# Altium schematic sheet ideal_diode.SchDoc
size A4; SheetNumber: 4; SheetTotal: 7
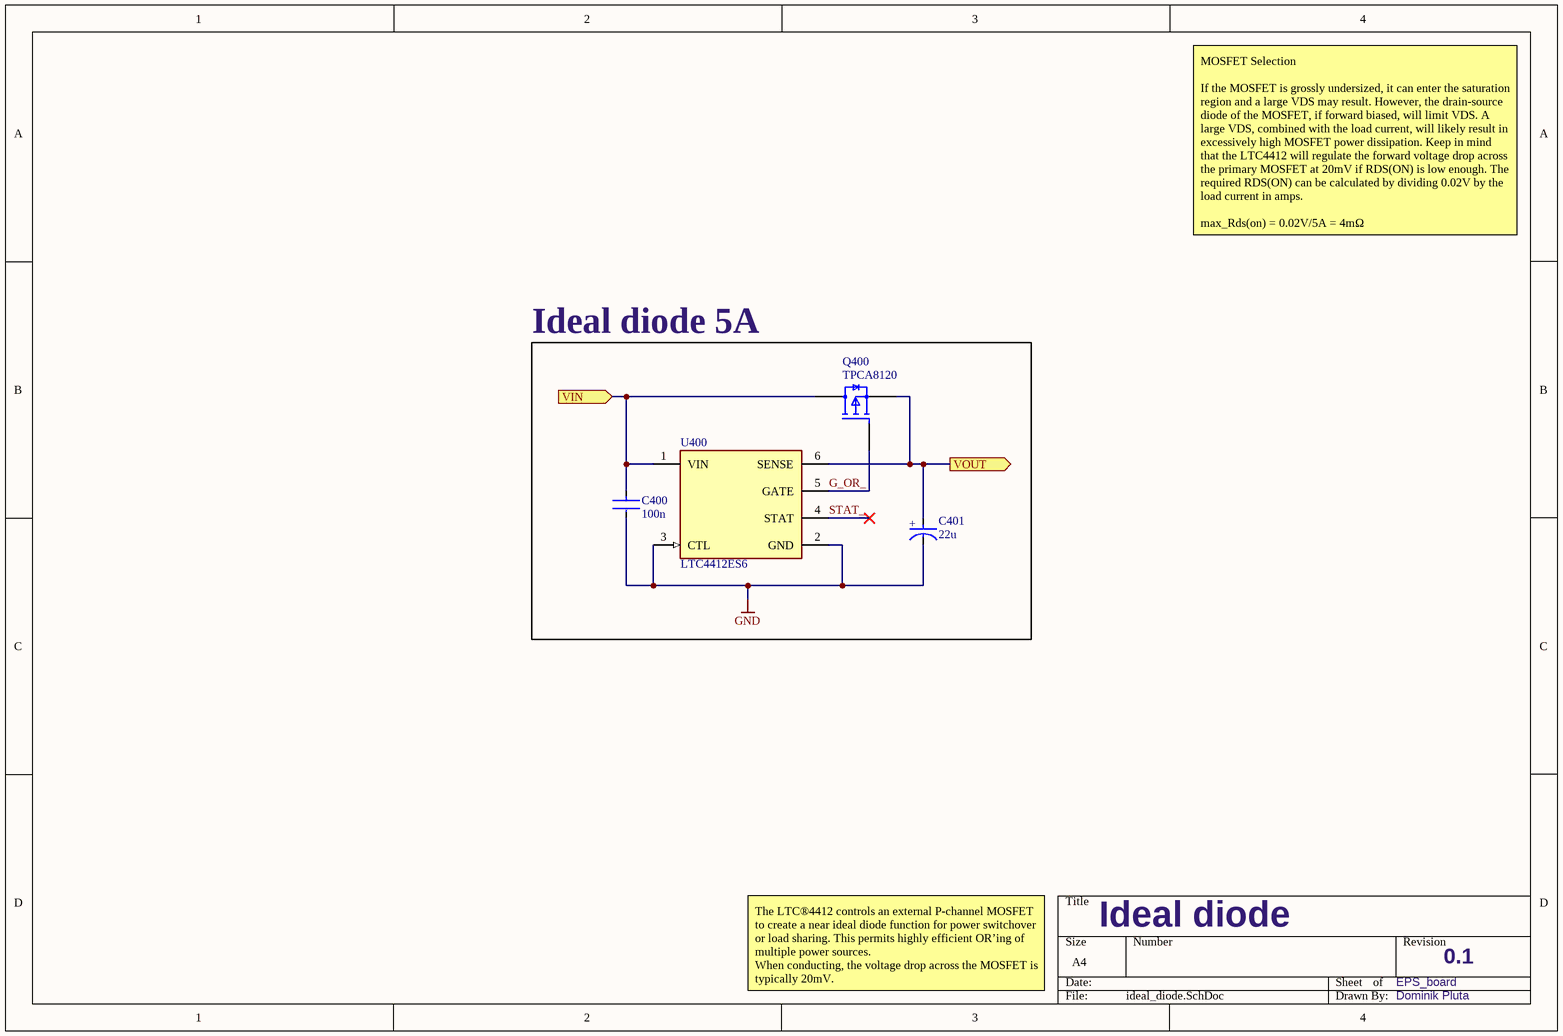
[diagram p0: ideal_diode.SchDoc]

## Parts
C400  100n  [FP-C0603C-CF-MFG]
C401  22u  [FP-T491B107K006AT-MFG]
Q400  TPCA8120  [TPCA8120]
U400  LTC4412ES6  [FP-S6-6-05-08-1636-IPC_C]

## Blocks framed on the sheet
Ideal diode 5A: C400 C401 Q400 U400

## Ports
VIN (in, see EPS[2B]), VOUT (out, see EPS[2B])

## Nets
GND: C400.2 C401.1(C) U400.2(GND) U400.3(CTL)
G_OR_: Q400.2(G) U400.5(GATE)
STAT_: U400.4(STAT)
VIN: C400.1 Q400.3(D) U400.1(VIN) ; port VIN
VOUT: C401.2(A) Q400.1(S) U400.6(SENSE) ; port VOUT

## Notes on the sheet
- MOSFET Selection
  If the MOSFET is grossly undersized, it can enter the saturation region and a large VDS may result. However, the drain-source diode of the MOSFET, if forward biased, will limit VDS. A large VDS, combined with the load current, will likely result in excessively high MOSFET power dissipation. Keep in mind that the LTC4412 will regulate the forward voltage drop across the primary MOSFET at 20mV if RDS(ON) is low enough. The required RDS(ON) can be calculated by dividing 0.02V by the load current in amps.
  max_Rds(on) = 0.02V/5A = 4mΩ
- The LTC®4412 controls an external P-channel MOSFET to create a near ideal diode function for power switchover or load sharing. This permits highly efficient OR’ing of multiple power sources.
  When conducting, the voltage drop across the MOSFET is typically 20mV.
- Ideal diode
- EPS_board
- 0.1
- Dominik Pluta
- (in symbol CMP-03017-000031-1) +

## Library data of the parts
C400 = CMP-2006-03061-2: CAP 0.1 μF, X5R or X7R ceramic; Tolerance: 10; Capacitance: 0.10 μF; Material: Ceramic; Category: Cap; Package: 0603; ComponentLink2Description: Datasheet; Device Class L1: Passive Components; Device Class L3: Ceramic Capacitors; ComponentLink2URL: https://api.kemet.com/component-edge/download/datasheet/C0603C100J5GACAUTO.pdf; Device Class L2: Capacitors
C401 = CMP-03017-000031-1: CAP TANT 22UF 10% 6.3V 1411; ESR (Equivalent Series Resistance): 3R; Dielectric Material: Tantalum; Leakage Current: 6.3uA; Dissipation Factor: 15%; Polarity: Polar; Case Code (Imperial): 1411; Voltage Rating: 6.3V; Length: 3.5mm; Depth: 2.8mm; Case/Package: 1411; Height - Seated (Max): 0.083inch; Termination: SMD/SMT; REACH SVHC: No SVHC; Width: 2.8mm; Mount: Surface Mount; Number of Pins: 2; Case Code (Metric): 3528; Tolerance: 10%; Lead Free: Lead Free; Capacitance: 22uF; Features: General Purpose; Height: 1.9mm
Q400 = TPCA8120: MOSFET P-CH 30V 45A SOP Advance; pin to pad: 1>1+2+3 2>4 3>5+6+7+8+9; Drain-source voltage (max): -30V; Gate-source voltage (max): -25/+20V; Drain current (DC): -45A; Gate threshold voltage (max): -2V; RDS(ON) @ VGS = -10: 2.4 mΩ
U400 = CMP-0479-00425-2: IC OR CTRLR SRC SELECT TSOT23-6; Min Supply Voltage: 2.5V; Max Supply Voltage: 28V; Turn-On Delay Time: 110us; Number of Channels: 1; Lead Free: Lead Free; Length: 2.9mm; Radiation Hardening: No; RoHS Compliant: Yes; Package Quantity: 1; Min Operating Temperature: -40°C; Series: PowerPath™; Packaging: Tape and Reel; Width: 1.75mm; Height: 0.9mm; Number of Pins: 6; Max Operating Temperature: 85°C; Number of Outputs: 1; Case/Package: TSOT; REACH SVHC: No SVHC